# Altium schematic sheet [1] BLOCK DIAGRAM.SchDoc
size 431 x 279 mm; DocumentNumber: 2; SheetNumber: 2; SheetTotal: 9
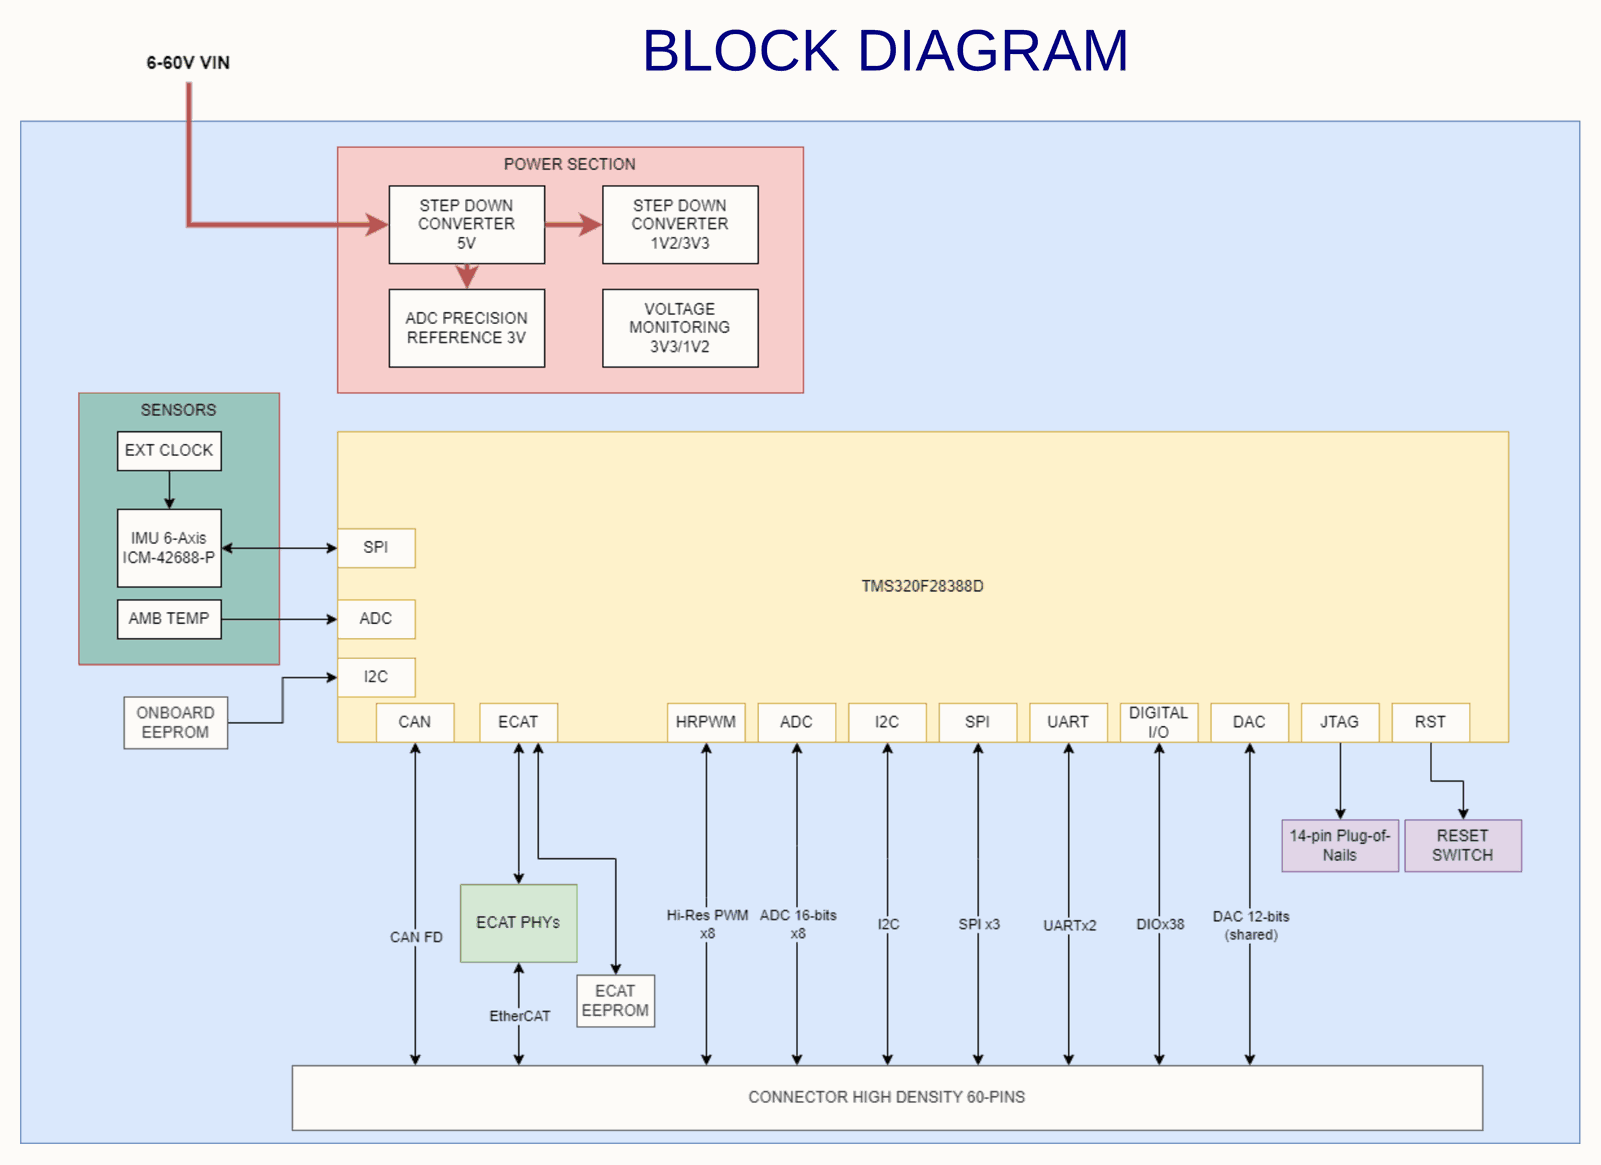
[diagram p0: [1] BLOCK DIAGRAM.SchDoc]

## Notes on the sheet
- BLOCK DIAGRAM
- REVISION
- DESCRIPTION
- DATE
- PROJECT:
- AUTHOR:
- TITLE:
- FILE NAME:
- CUR REV:
- PCB:
- SHEET:
- DATE:
- OF